# Altium project CanBusTester.PrjPcb
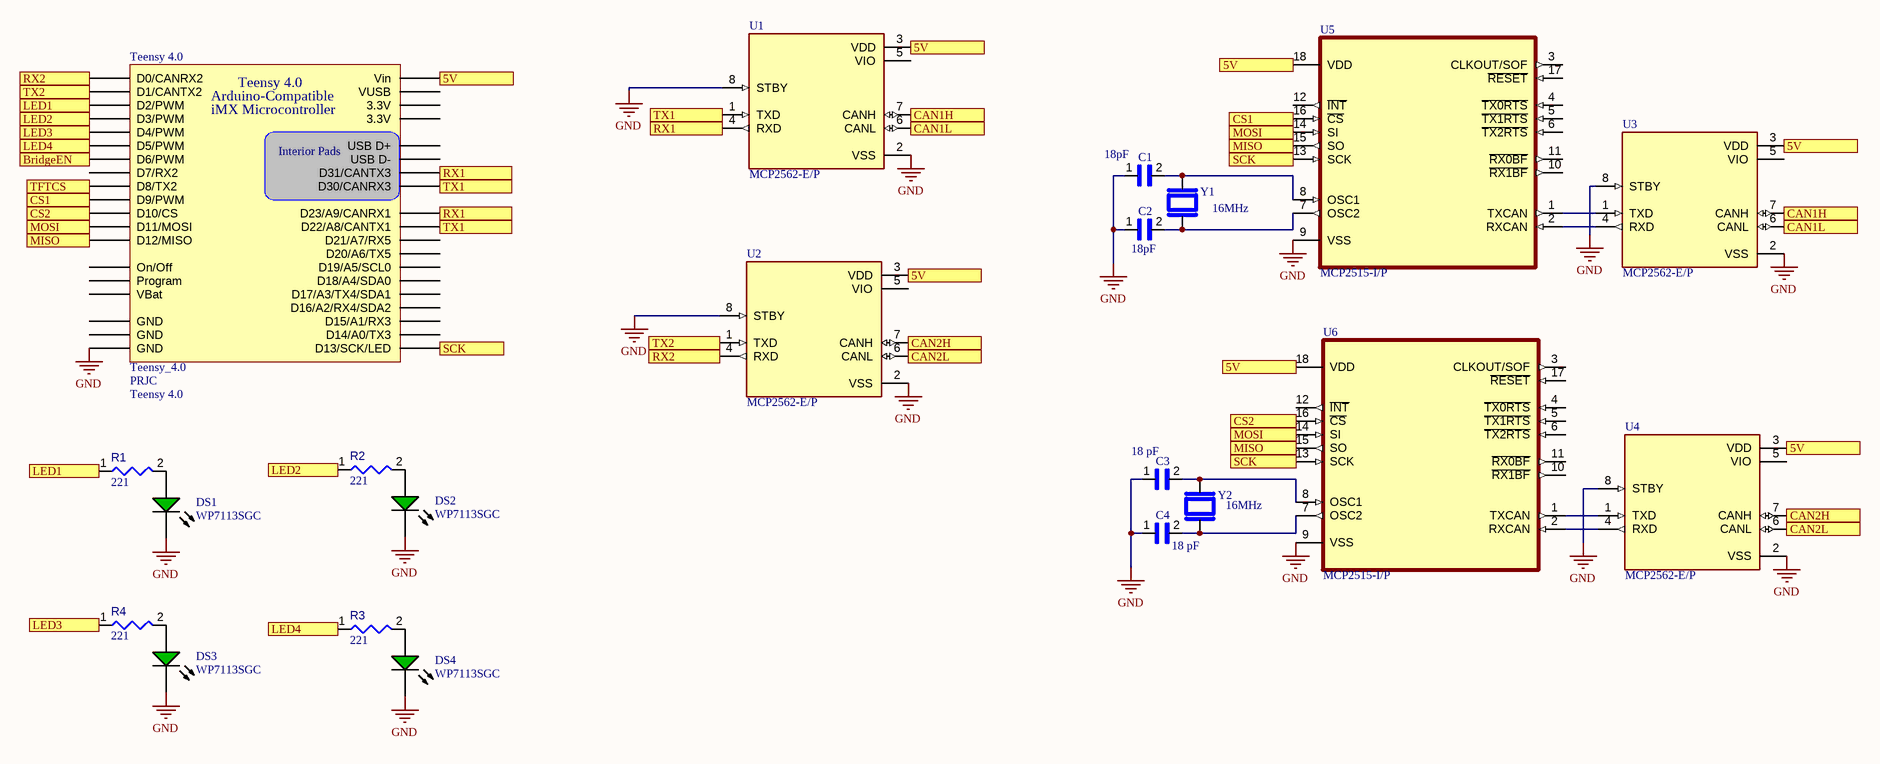
[diagram p0: CircuitBoard.SchDoc]
CAGE_CODE: ?????; CONTRACT_NUMBER: <CONTRACT NO>; DOC_NO_ASSY_DWG: <ASSY DWG NO>; DOC_NO_BOM: <BOM DOC NO>; DOC_NO_FAB_DWG: <FAB DWG NO>; DOC_NO_SCH_DWG: <SCH DWG NO>; PCB_2_DEC_TOL: +/-.01; PCB_3_DEC_TOL: +/-.010; PCB_ANG_TOL: +/-1/2; PCB_ASSEMBLY_NO: <PCB ASSY NO>; PCB_CHECKER: - -----; PCB_CHECKER_APP_DATE: --/--/----; PCB_DESIGNER: - -----; PCB_DESIGNER_APP_DATE: --/--/----; PCB_DWG_NO: <PCB DWG NO>; PCB_ENGINEER: - -----; PCB_ENGINEER_APP_DATE: --/--/----; PCB_PART_NUMBER: <PCB PN>; PCB_REV: A; SCH_REV: A
2 sheets, 25 parts. Net scope: flat (ports and power ports of the same name join across sheets).
Board file: CanBusTester.PcbDoc
Sheets:
  CircuitBoard.SchDoc
  Connectors.SchDoc

## Sheet CircuitBoard.SchDoc
size 431 x 279 mm; SheetNumber: 1; SheetTotal: 2; ENG_APP_DATE: --/--/--; DSN_APP_DATE: --/--/--; CHK_APP_DATE: --/--/--

### Parts
C1  18pF  [CAPRB250W50L400T250H550]
C2  18pF  [CAPRB250W50L400T250H550]
C3  18 pF  [CAPRB250W50L400T250H550]
C4  18 pF  [CAPRB250W50L400T250H550]
DS1  WP7113SGC  [KING-WP7113SGC_V]
DS2  WP7113SGC  [KING-WP7113SGC_V]
DS3  WP7113SGC  [KING-WP7113SGC_V]
DS4  WP7113SGC  [KING-WP7113SGC_V]
R1  value 221  [RESA60-630X240]  (hidden comment: MFR-25FBF52-221R)
R2  value 221  [RESA60-630X240]  (hidden comment: MFR-25FBF52-221R)
R3  value 221  [RESA60-630X240]  (hidden comment: MFR-25FBF52-221R)
R4  value 221  [RESA60-630X240]  (hidden comment: MFR-25FBF52-221R)
Teensy_4.0  Teensy_4.0  Manufacturer: PRJC  [Teensy 4.0]
U1  MCP2562-E/P  [DIP787W45P254L1016H533Q8]
U2  MCP2562-E/P  [DIP787W45P254L1016H533Q8]
U3  MCP2562-E/P  [DIP787W45P254L1016H533Q8]
U4  MCP2562-E/P  [DIP787W45P254L1016H533Q8]
U5  MCP2515-I/P  [DIP254P762X432-18]
U6  MCP2515-I/P  [DIP254P762X432-18]
Y1  16MHz  [XTAL_HC49P488W46L1150T500H350]
Y2  16MHz  [XTAL_HC49P488W46L1150T500H350]

### Ports
5V, BridgeEN, CAN1H, CAN1L, CAN2H, CAN2L, CS1, CS2, LED1, LED2, LED3, LED4, MISO, MOSI, RX1, RX2, SCK, TFTCS, TX1, TX2

### Nets
GND: C1.1 C2.1 C3.1 C4.1 DS1.2(K) DS2.2(K) DS3.2(K) DS4.2(K) Teensy_4.0.G3(GND) U1.2(VSS) U1.8(STBY) U2.2(VSS) U2.8(STBY) U3.2(VSS) U3.8(STBY) U4.2(VSS) U4.8(STBY) U5.9(VSS) U6.9(VSS)
NetC1_2: C1.2 U5.8(OSC1) Y1.2
NetC2_2: C2.2 U5.7(OSC2) Y1.1
NetC3_2: C3.2 U6.8(OSC1) Y2.2
NetC4_2: C4.2 U6.7(OSC2) Y2.1
NetC5_2: U1.6(CANL) U3.6(CANL) ; port CAN1L
NetC5_3: U1.7(CANH) U3.7(CANH) ; port CAN1H
NetDS1_1: DS1.1(A) R1.2
NetDS2_1: DS2.1(A) R2.2
NetDS3_1: DS3.1(A) R4.2
NetDS4_1: DS4.1(A) R3.2
NetJ1_4: U2.6(CANL) U4.6(CANL) ; port CAN2L
NetJ1_8: U2.7(CANH) U4.7(CANH) ; port CAN2H
NetR1_1: R1.1 Teensy_4.0.2(D2/PWM) ; port LED1
NetR2_1: R2.1 Teensy_4.0.3(D3/PWM) ; port LED2
NetR3_1: R3.1 Teensy_4.0.5(D5/PWM) ; port LED4
NetR4_1: R4.1 Teensy_4.0.4(D4/PWM) ; port LED3
NetTeensy_4.0_0: Teensy_4.0.0(D0/CANRX2) U2.4(RXD) ; port RX2
NetTeensy_4.0_1: Teensy_4.0.1(D1/CANTX2) U2.1(TXD) ; port TX2
NetTeensy_4.0_6: Teensy_4.0.6(D6/PWM) ; port BridgeEN
NetTeensy_4.0_8: Teensy_4.0.8(D8/TX2) ; port TFTCS
NetTeensy_4.0_9: Teensy_4.0.9(D9/PWM) U5.16(~{CS}) ; port CS1
NetTeensy_4.0_10: Teensy_4.0.10(D10/CS) U6.16(~{CS}) ; port CS2
NetTeensy_4.0_11: Teensy_4.0.11(D11/MOSI) U5.14(SI) U6.14(SI) ; port MOSI
NetTeensy_4.0_12: Teensy_4.0.12(D12/MISO) U5.15(SO) U6.15(SO) ; port MISO
NetTeensy_4.0_13: Teensy_4.0.13(D13/SCK/LED) U5.13(SCK) U6.13(SCK) ; port SCK
NetTeensy_4.0_22: Teensy_4.0.22(D22/A8/CANTX1) Teensy_4.0.CRX3(D30/CANRX3) U1.1(TXD) ; port TX1
NetTeensy_4.0_23: Teensy_4.0.23(D23/A9/CANRX1) Teensy_4.0.CTX3(D31/CANTX3) U1.4(RXD) ; port RX1
NetTeensy_4.0_Vin: Teensy_4.0.Vin U1.3(VDD) U2.3(VDD) U3.3(VDD) U4.3(VDD) U5.18(VDD) U6.18(VDD) ; port 5V
NetU3_1: U3.1(TXD) U5.1(TXCAN)
NetU3_4: U3.4(RXD) U5.2(RXCAN)
NetU4_1: U4.1(TXD) U6.1(TXCAN)
NetU4_4: U4.4(RXD) U6.2(RXCAN)

Not connected (* = marked no-connect by the designer): Teensy_4.0 3V3a(3.3V) 3V3b(3.3V) 7(D7/RX2) 14(D14/A0/TX3) 15(D15/A1/RX3) 16(D16/A2/RX4/SDA2) 17(D17/A3/TX4/SDA1) 18(D18/A4/SDA0) 19(D19/A5/SCL0) 20(D20/A6/TX5) 21(D21/A7/RX5) D+(USB_D+) D-(USB_D-) G1(GND) G2(GND) On(On/Off) P(Program) VBat VUSB; U1 5(VIO); U2 5(VIO); U3 5(VIO); U4 5(VIO); U5 3(CLKOUT/SOF) 4(~{TX0RTS}) 5(~{TX1RTS}) 6(~{TX2RTS}) 10(~{RX1BF}) 11(~{RX0BF}) 12(~{INT}) 17(~{RESET}); U6 3(CLKOUT/SOF) 4(~{TX0RTS}) 5(~{TX1RTS}) 6(~{TX2RTS}) 10(~{RX1BF}) 11(~{RX0BF}) 12(~{INT}) 17(~{RESET})

### Notes on the sheet
- DWG. NO.
- REV.
- SHT.
- THIS DOCUMENT AND THE DATA DISCLOSED HEREIN OR HEREWITH IS THE PROPERTY OF ALTIUM LIMITED AND MAY BE FREELY DISTRIBUTED IN WHOLE. NO RIGHTS ARE RESERVED OR EXPRESS OR IMPLIED WARANTEE GIVEN.
- REVISION
- DESCRIPTION
- DATE
- APPROVED
- ENG:
- APPROVALS
- PROJECT
- DSN:
- CHK:
- REFERENCE DOCUMENTS
- PROJECT REVISION:
- TITLE
- DOCUMENT REVISION:
- DESIGN ITEM:
- BOM:
- FAB DWG:
- PCB DWG:
- ASSY DWG:
- SCALE:
- SIZE
- B
- CAGE CODE
- FILE NAME
- DWG NO.
- SHEET
- OF
- REV
- (in symbol CMP-006-000003-1) Arduino-Compatible; iMX Microcontroller; Interior Pads

### Library data of the parts
C1-C4 = FG18C0G2A180JNT06: Cap Ceramic 18pF 100V C0G 5% Radial 2.5mm 125Â°C Ammo; MF: TDK; Package: Radial TDK Corporation; Purchase-URL: https://pricing.snapeda.com/search/part/FG18C0G2A180JNT06/?ref=eda; Value: *; Availability: In Stock; SnapEDA_Link: https://www.snapeda.com/parts/FG18C0G2A180JNT06/TDK/view-part/?ref=snap; MP: FG18C0G2A180JNT06; Price: None; Check_prices: https://www.snapeda.com/parts/FG18C0G2A180JNT06/TDK/view-part/?ref=eda
DS1-DS4 = CMP-007-00032-2: The Super Bright Green Source Color Device, 2.2 V, -40 to 85 degC, 2-Pin THD, RoHS, Tape and Reel; Manufacturer: Kingbright; Luminous Intensity: 200mcd; Nominal Vf: 2.2V; Viewing Angle: 20degrees; Lens Style: Clear; Mounting Technology: TH; Forward Voltage: 2.2V; Colour: Green; Package Quantity: 1000; Datasheet Version: Rev. 9B, 01/2015; RoHS Compliant: True; Case/Package: Radial; Package Description: 2-Pin Through Hole Device, Dia 5.9 mm, Body Length 8.6 mm; Packaging: Bulk; Illumination Colour: Green; Datasheet URL: http://www.kingbrightusa.com/images/catalog/SPEC/WP7113SGC.pdf; Package Reference: WP7113SGC
R1-R4 = CMP-009-00051-4: Axial Resistor, 221 Ohm, +/- 1%, 250 mW, -55 to 155 degC, 2-Pin THD, RoHS, Bulk; Manufacturer: Yageo; Power: 250mW; Voltage Rating: 250V; Package Quantity: 200; Manufacturer URL: http://www.yageo.com/; Case/Package: Axial; Package Reference: MFR-25; RoHS Compliant: True; Mounting Technology: TH; Datasheet URL: http://www.yageo.com/documents/recent/Yageo%20LR_MFR_2013.pdf; Packaging: Bulk; Package Description: 2-Pin Axial Lead, Dia 2.4 mm, Body Length 6.3 mm; Max Operating Temperature: 155°C; Tolerance: 1%; Datasheet Version: Apr-13; Min Operating Temperature: -55°C
Teensy_4.0 = CMP-006-000003-1: 32 Bit Arduino-Compatible iMX Microcontroller; PartNumber: Teensy 4.0; Pin Count: 38; Design Item ID: Teensy_4.0; Source: Teensy.SchLib; Component Type: Standard
U1-U4 = CMP-003-000000-1: 1/1 Transceiver Half CANbus 8-PDIP; MF: Microchip; Value: *; Package: DIP-8 Microchip; Component Type: Standard; Design Item ID: MCP2562-E/P; Source: SnapEDAsch.SchLib; Pin Count: 8; SnapEDA_Link: https://www.snapeda.com/parts/MCP2562-E/P/Microchip/view-part/290285/?ref=snap; MP: MCP2562-E/P; Digi-Key_Part_Number: MCP2562-E/P-ND; DigiKey-Purchase-URL: https://snapeda.com/shop?store=DigiKey&id=290285
U5 U6 = MCP2515-I/P: CAN 1Mbps Sleep/Standby 3.3V/5V 18-Pin PDIP Tube; MF: Microchip Technology; Purchase-URL: https://pricing.snapeda.com/search/part/MCP2515-I/P/?ref=eda; Package: PDIP-18 Micrel; MP: MCP2515-I/P; Value: *; SnapEDA_Link: https://www.snapeda.com/parts/MCP2515-I/P/Microchip/view-part/?ref=snap; Availability: In Stock; Price: None; Check_prices: https://www.snapeda.com/parts/MCP2515-I/P/Microchip/view-part/?ref=eda
Y1 Y2 = ABL-16.000MHZ-B2: HC/49US (AT49) MICROPROCESSOR CRYSTAL; MF: Abracon; Availability: In Stock; SnapEDA_Link: https://www.snapeda.com/parts/ABL-16.000MHZ-B2/Abracon+LLC/view-part/?ref=snap; MP: ABL-16.000MHZ-B2; Price: None; Value: *; Check_prices: https://www.snapeda.com/parts/ABL-16.000MHZ-B2/Abracon+LLC/view-part/?ref=eda; Purchase-URL: https://pricing.snapeda.com/search/part/ABL-16.000MHZ-B2/?ref=eda; Package: HC-49/US ABRACON

## Sheet Connectors.SchDoc
size A; SheetNumber: 2; SheetTotal: 3
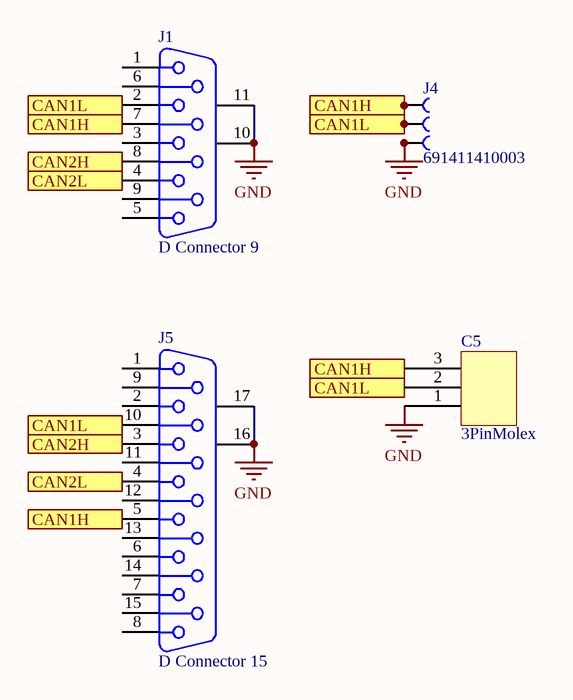
[diagram p1: Connectors.SchDoc]

### Parts
C5  3PinMolex  [3PinMolex]
J1  D Connector 9  [DSUB1.385-2H9]
J4  691411410003  [691411410003]
J5  D Connector 15  [DSUB1.385-2H15]

### Ports
CAN1H, CAN1L, CAN2H, CAN2L

### Nets
GND: C5.1 J1.10(MH1) J1.11(MH2) J4.3 J4.A3 J5.16(MH1) J5.17(MH2)
NetC5_2: C5.2 J1.2 J4.2 J4.A2 J5.10 ; port CAN1L
NetC5_3: C5.3 J1.7 J4.1 J4.A1 J5.5 ; port CAN1H
NetJ1_4: J1.4 J5.4 ; port CAN2L
NetJ1_8: J1.8 J5.3 ; port CAN2H

Not connected (* = marked no-connect by the designer): J1 1 3 5 6 9; J5 1 2 6 7 8 9 11 12 13 14 15

### Library data of the parts
J1 = D Connector 9: Receptacle Assembly, 9 Position, Right Angle; PackageDocument: O; Positions: 9; Published: 15-Jun-2001; LatestRevisionDate: 17-Jul-2002; LatestRevisionNote: Re-released for DXP Platform.; DatasheetDocument: 1-Sep-1999; PackageReference: 788750; Publisher: Altium Limited; Orientation: Right Angle; Gender: Receptacle
J4 = 691411410003: TERM BLK 3P SIDE ENT 7.62MM PCB; MF: Wurth Electronics Inc.; Availability: In Stock; Package: None; Value: *; Price: None; SnapEDA_Link: https://www.snapeda.com/parts/691411410003/Wurth+Electronics+Inc/view-part/?ref=snap; Check_prices: https://www.snapeda.com/parts/691411410003/Wurth+Electronics+Inc/view-part/?ref=eda; Purchase-URL: https://pricing.snapeda.com/search/part/691411410003/?ref=eda; MP: 691411410003
J5 = D Connector 15: Receptacle Assembly, 15 Position, Right Angle; PackageDocument: O; Positions: 15; Published: 15-Jun-2001; LatestRevisionDate: 17-Jul-2002; LatestRevisionNote: Re-released for DXP Platform.; DatasheetDocument: 1-Sep-99; PackageReference: 788757; Publisher: Altium Limited; Orientation: Right Angle; Gender: Receptacle

## Nets that join several sheets
GND: CircuitBoard (19 pins), Connectors (7 pins)
NetC5_2: CircuitBoard (U1.6 U3.6), Connectors (5 pins)
NetC5_3: CircuitBoard (U1.7 U3.7), Connectors (5 pins)
NetJ1_4: CircuitBoard (U2.6 U4.6), Connectors (J1.4 J5.4)
NetJ1_8: CircuitBoard (U2.7 U4.7), Connectors (J1.8 J5.3)